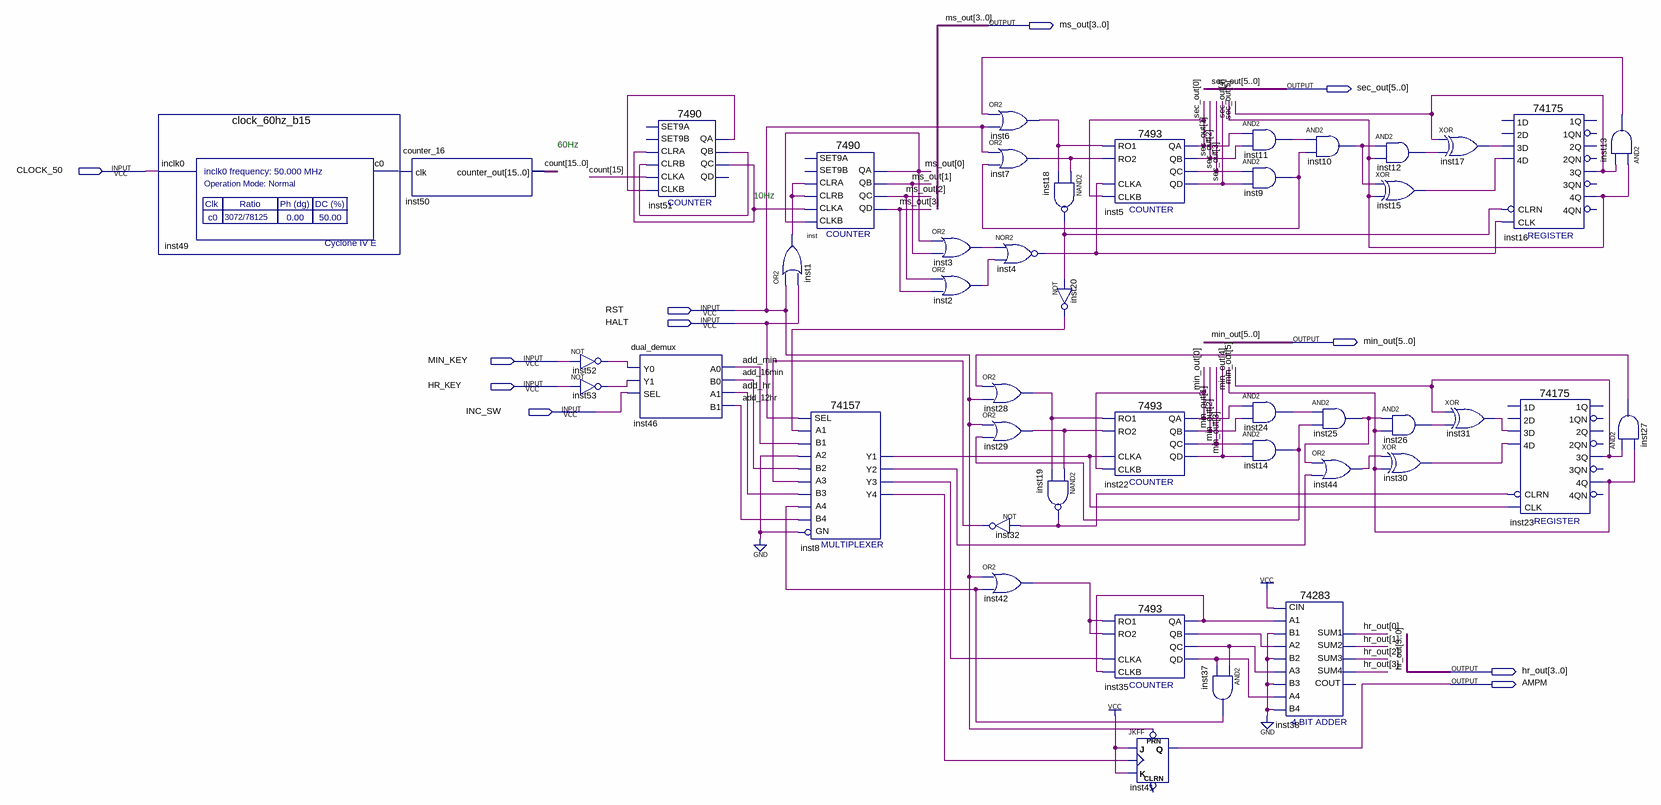
[diagram p0: schematic sheet]
// Quartus schematic binary_clock_datapath_rev2.bdf as structural Verilog: 44 symbols, 11 pins
module binary_clock_datapath_rev2 (
  input  CLOCK_50,
  input  RST,
  input  HALT,
  input  MIN_KEY,
  input  HR_KEY,
  input  INC_SW,
  output [3:0] ms_out,
  output [5:0] sec_out,
  output [5:0] min_out,
  output [3:0] hr_out,
  output AMPM
);

  wire add_12hr, add_16min, add_hr, add_min, inst1_out, inst2_out, inst3_out, inst4_out, inst6_out,
       inst7_out, inst8_y1, inst8_y2, inst8_y3, inst8_y4, inst9_out, inst10_out, inst11_out, inst12_out,
       inst13_out, inst14_out, inst15_out, inst17_out, inst18_out, inst19_out, inst20_out, inst24_out,
       inst25_out, inst26_out, inst27_out, inst28_out, inst29_out, inst30_out, inst31_out, inst32_out,
       inst35_qa, inst35_qb, inst35_qc, inst35_qd, inst37_out, inst42_out, inst44_out, inst49_c0, inst51_qa,
       inst51_qb, inst51_qc, inst52_out, inst53_out;
  wire [15:0] count;

  clock_60hz_b15 inst49 (.inclk0(CLOCK_50), .c0(inst49_c0));
  counter_16 inst50 (.clk(inst49_c0), .counter_out(count));
  not inst52 (inst52_out, MIN_KEY);
  not inst53 (inst53_out, HR_KEY);
  dual_demux inst46 (
    .Y0(inst52_out), .Y1(inst53_out), .SEL(INC_SW), .A0(add_min), .B0(add_16min), .A1(add_hr), .B1(add_12hr));
  \7490  inst51 (
    .CLRA(inst51_qc), .CLKB(inst51_qa), .CLKA(count[15]), .CLRB(inst51_qb), .QA(inst51_qa), .QB(inst51_qb),
    .QC(inst51_qc));  // open: SET9A, SET9B, QD
  or inst1 (inst1_out, RST, HALT);
  \7490  inst (
    .CLRA(inst1_out), .CLKB(ms_out[0]), .CLKA(inst51_qc), .CLRB(inst1_out), .QD(ms_out[3]), .QA(ms_out[0]),
    .QB(ms_out[1]), .QC(ms_out[2]));  // open: SET9A, SET9B
  \74157  inst8 (
    .A1(inst20_out), .B1(add_min), .SEL(HALT), .B2(add_16min), .A3(inst32_out), .B3(add_hr), .A2(1'b0),
    .B4(add_12hr), .GN(1'b0), .A4(inst37_out), .Y2(inst8_y2), .Y1(inst8_y1), .Y4(inst8_y4), .Y3(inst8_y3));
  or inst3 (inst3_out, ms_out[0], ms_out[1]);
  or inst2 (inst2_out, ms_out[2], ms_out[3]);
  or inst6 (inst6_out, inst13_out, RST);
  or inst7 (inst7_out, RST, inst9_out);
  nor inst4 (inst4_out, inst3_out, inst2_out);
  or inst28 (inst28_out, inst27_out, RST);
  or inst29 (inst29_out, RST, inst14_out);
  not inst32 (inst32_out, inst19_out);
  or inst42 (inst42_out, RST, inst37_out);
  nand inst18 (inst18_out, inst7_out, inst6_out);
  nand inst19 (inst19_out, inst29_out, inst28_out);
  not inst20 (inst20_out, inst18_out);
  \7493  inst5 (
    .RO1(inst6_out), .RO2(inst7_out), .CLKA(inst4_out), .CLKB(sec_out[0]), .QC(sec_out[2]), .QB(sec_out[1]),
    .QA(sec_out[0]), .QD(sec_out[3]));
  \7493  inst22 (
    .RO1(inst28_out), .RO2(inst29_out), .CLKA(inst8_y1), .CLKB(min_out[0]), .QC(min_out[2]), .QB(min_out[1]),
    .QA(min_out[0]), .QD(min_out[3]));
  \7493  inst35 (
    .RO1(inst42_out), .RO2(inst42_out), .CLKA(inst8_y3), .CLKB(inst35_qa), .QC(inst35_qc), .QB(inst35_qb),
    .QA(inst35_qa), .QD(inst35_qd));
  JKFF inst41 (.PRN(RST), .K(1'b1), .J(1'b1), .CLK(inst8_y4), .Q(AMPM));  // open: CLRN
  and inst11 (inst11_out, sec_out[0], sec_out[1]);
  and inst9 (inst9_out, sec_out[2], sec_out[3]);
  and inst24 (inst24_out, min_out[0], min_out[1]);
  and inst14 (inst14_out, min_out[2], min_out[3]);
  and inst37 (inst37_out, inst35_qc, inst35_qd);
  \74283  inst38 (
    .CIN(1'b1), .A1(inst35_qa), .A2(inst35_qb), .B2(1'b0), .A3(inst35_qc), .A4(inst35_qd), .B4(1'b0),
    .B1(1'b0), .B3(1'b0), .SUM4(hr_out[3]), .SUM1(hr_out[0]), .SUM2(hr_out[1]), .SUM3(hr_out[2]));  // open: COUT
  and inst10 (inst10_out, inst11_out, inst9_out);
  and inst25 (inst25_out, inst24_out, inst14_out);
  or inst44 (inst44_out, inst25_out, inst8_y2);
  and inst12 (inst12_out, inst10_out, sec_out[4]);
  xor inst15 (inst15_out, inst10_out, sec_out[4]);
  and inst26 (inst26_out, inst25_out, min_out[4]);
  xor inst30 (inst30_out, inst44_out, min_out[4]);
  xor inst17 (inst17_out, sec_out[5], inst12_out);
  xor inst31 (inst31_out, min_out[5], inst26_out);
  \74175  inst16 (
    .CLRN(inst18_out), .CLK(inst4_out), .\3D (inst17_out), .\4D (inst15_out), .\3Q (sec_out[5]),
    .\4Q (sec_out[4]));  // open: 2D, 1D, 1QN, 1Q, 2QN, 2Q, 4QN, 3QN
  \74175  inst23 (
    .CLRN(inst19_out), .CLK(inst8_y1), .\3D (inst31_out), .\4D (inst30_out), .\3Q (min_out[5]),
    .\4Q (min_out[4]));  // open: 2D, 1D, 1QN, 1Q, 2QN, 2Q, 4QN, 3QN
  and inst13 (inst13_out, sec_out[4], sec_out[5]);
  and inst27 (inst27_out, min_out[5], min_out[4]);

  // Notes on the sheet:
  //   60Hz
  //   10Hz
endmodule
